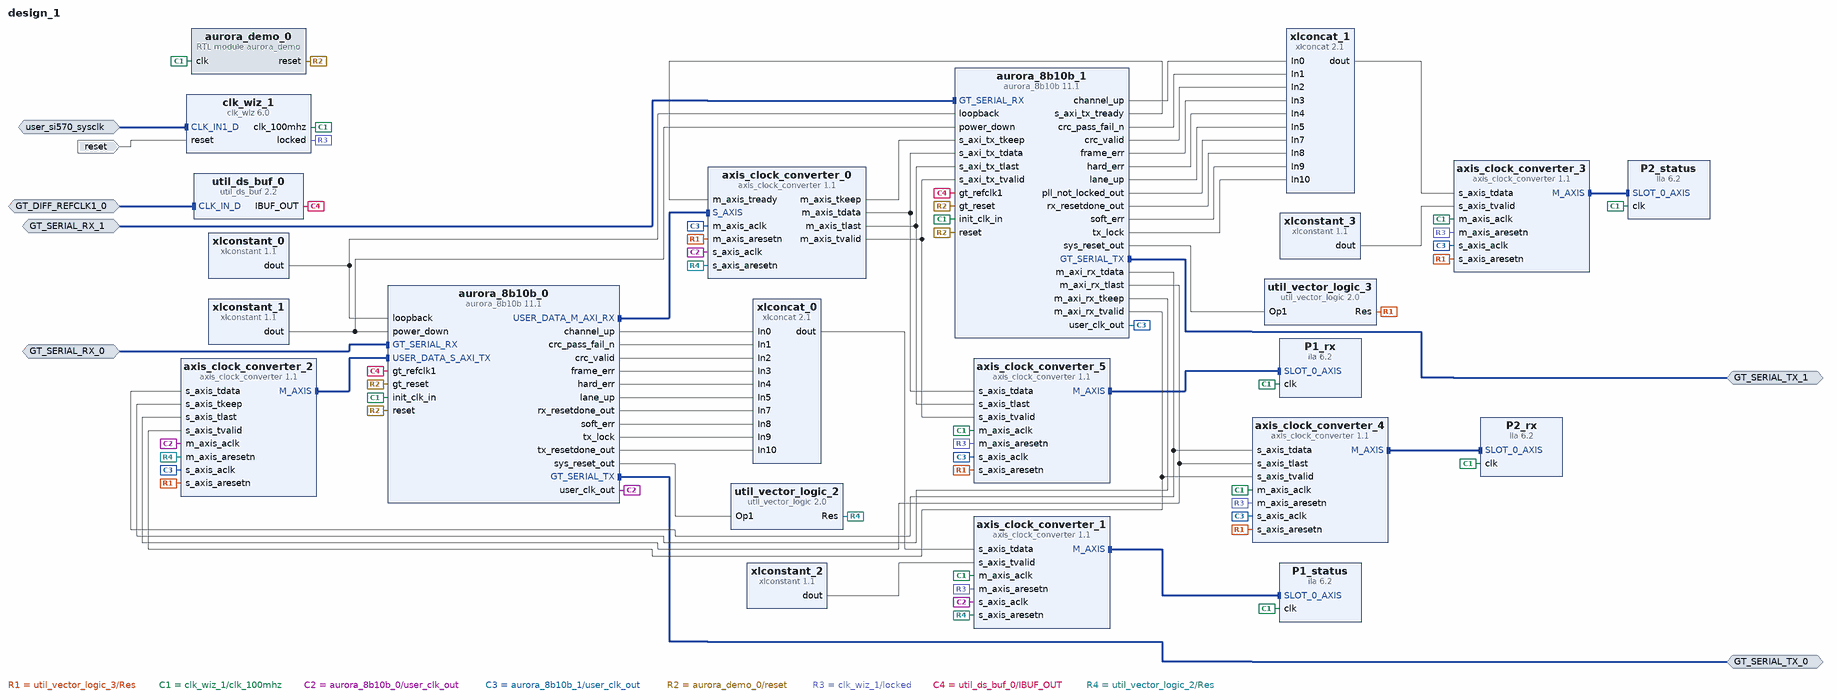
[diagram p0: block diagram of the top level]
# Vivado block design design_1, xczu7ev-ffvc1156-2-e, Vivado 2021.1
create_bd_design design_1

create_bd_intf_port -mode Slave -vlnv xilinx.com:interface:diff_clock_rtl:1.0 user_si570_sysclk
set_property -dict {CONFIG.FREQ_HZ 300000000} [get_bd_intf_ports user_si570_sysclk]
create_bd_intf_port -mode Slave -vlnv xilinx.com:display_aurora:GT_Serial_Transceiver_Pins_RX_rtl:1.0 GT_SERIAL_RX_0
create_bd_intf_port -mode Master -vlnv xilinx.com:display_aurora:GT_Serial_Transceiver_Pins_TX_rtl:1.0 GT_SERIAL_TX_0
create_bd_intf_port -mode Slave -vlnv xilinx.com:interface:diff_clock_rtl:1.0 GT_DIFF_REFCLK1_0
set_property -dict {CONFIG.FREQ_HZ 250000000} [get_bd_intf_ports GT_DIFF_REFCLK1_0]
create_bd_intf_port -mode Slave -vlnv xilinx.com:display_aurora:GT_Serial_Transceiver_Pins_RX_rtl:1.0 GT_SERIAL_RX_1
create_bd_intf_port -mode Master -vlnv xilinx.com:display_aurora:GT_Serial_Transceiver_Pins_TX_rtl:1.0 GT_SERIAL_TX_1
create_bd_port -dir I -type rst reset
set_property -dict {CONFIG.POLARITY ACTIVE_HIGH} [get_bd_ports reset]

create_bd_cell -type ip -vlnv xilinx.com:ip:aurora_8b10b:11.1 aurora_8b10b_0
set_property -dict [list \
  CONFIG.CHANNEL_ENABLE X0Y10 \
  CONFIG.C_DRP_IF false \
  CONFIG.C_LANE_WIDTH 2 \
  CONFIG.C_LINE_RATE 2 \
  CONFIG.C_REFCLK_FREQUENCY 250 \
  CONFIG.C_REFCLK_SOURCE {MGTREFCLK1 of Quad X0Y2} \
  CONFIG.C_START_LANE X0Y10 \
  CONFIG.C_START_QUAD Quad_X0Y2 \
  CONFIG.C_USE_CRC true \
  CONFIG.SINGLEEND_GTREFCLK true \
  CONFIG.SupportLevel 1 \
] [get_bd_cells aurora_8b10b_0]
create_bd_cell -type ip -vlnv xilinx.com:ip:clk_wiz:6.0 clk_wiz_1
set_property -dict [list \
  CONFIG.CLKIN1_JITTER_PS 33.330000000000005 \
  CONFIG.CLKOUT1_JITTER 101.475 \
  CONFIG.CLKOUT1_PHASE_ERROR 77.836 \
  CONFIG.CLK_IN1_BOARD_INTERFACE user_si570_sysclk \
  CONFIG.CLK_OUT1_PORT clk_100mhz \
  CONFIG.MMCM_CLKFBOUT_MULT_F 4.000 \
  CONFIG.MMCM_CLKIN1_PERIOD 3.333 \
  CONFIG.MMCM_CLKIN2_PERIOD 10.0 \
  CONFIG.PRIM_SOURCE Differential_clock_capable_pin \
  CONFIG.RESET_BOARD_INTERFACE reset \
  CONFIG.USE_BOARD_FLOW true \
] [get_bd_cells clk_wiz_1]
create_bd_cell -type ip -vlnv xilinx.com:ip:xlconstant:1.1 xlconstant_0
set_property -dict {CONFIG.CONST_VAL 0 CONFIG.CONST_WIDTH 3} [get_bd_cells xlconstant_0]
create_bd_cell -type ip -vlnv xilinx.com:ip:xlconstant:1.1 xlconstant_1
set_property -dict {CONFIG.CONST_VAL 0} [get_bd_cells xlconstant_1]
create_bd_cell -type ip -vlnv xilinx.com:ip:ila:6.2 P2_status
set_property -dict {CONFIG.C_NUM_OF_PROBES 9 CONFIG.C_SLOT_0_AXI_PROTOCOL AXI4S} [get_bd_cells P2_status]
create_bd_cell -type ip -vlnv xilinx.com:ip:axis_clock_converter:1.1 axis_clock_converter_0
set_property -dict {CONFIG.HAS_TKEEP 1 CONFIG.HAS_TLAST 1 CONFIG.TDATA_NUM_BYTES 2} [get_bd_cells axis_clock_converter_0]
create_bd_cell -type ip -vlnv xilinx.com:ip:axis_clock_converter:1.1 axis_clock_converter_1
set_property -dict {CONFIG.SYNCHRONIZATION_STAGES 3 CONFIG.TDATA_NUM_BYTES 2} [get_bd_cells axis_clock_converter_1]
create_bd_cell -type ip -vlnv xilinx.com:ip:xlconstant:1.1 xlconstant_2
set_property -dict {CONFIG.CONST_VAL 1} [get_bd_cells xlconstant_2]
create_bd_cell -type ip -vlnv xilinx.com:ip:ila:6.2 P1_status
set_property -dict {CONFIG.C_NUM_OF_PROBES 9 CONFIG.C_SLOT_0_AXI_PROTOCOL AXI4S} [get_bd_cells P1_status]
create_bd_cell -type ip -vlnv xilinx.com:ip:xlconcat:2.1 xlconcat_0
set_property -dict {CONFIG.NUM_PORTS 16} [get_bd_cells xlconcat_0]
create_bd_cell -type ip -vlnv xilinx.com:ip:axis_clock_converter:1.1 axis_clock_converter_2
set_property -dict {CONFIG.HAS_TKEEP 1 CONFIG.HAS_TLAST 1 CONFIG.TDATA_NUM_BYTES 2} [get_bd_cells axis_clock_converter_2]
create_bd_cell -type module -reference aurora_demo aurora_demo_0
create_bd_cell -type ip -vlnv xilinx.com:ip:aurora_8b10b:11.1 aurora_8b10b_1
set_property -dict [list \
  CONFIG.CHANNEL_ENABLE X0Y11 \
  CONFIG.C_DRP_IF false \
  CONFIG.C_LANE_WIDTH 2 \
  CONFIG.C_LINE_RATE 2 \
  CONFIG.C_REFCLK_FREQUENCY 250 \
  CONFIG.C_REFCLK_SOURCE {MGTREFCLK1 of Quad X0Y2} \
  CONFIG.C_START_LANE X0Y11 \
  CONFIG.C_START_QUAD Quad_X0Y2 \
  CONFIG.C_USE_CRC true \
  CONFIG.SINGLEEND_GTREFCLK true \
  CONFIG.SupportLevel 1 \
] [get_bd_cells aurora_8b10b_1]
create_bd_cell -type ip -vlnv xilinx.com:ip:util_ds_buf:2.2 util_ds_buf_0
set_property -dict {CONFIG.C_BUF_TYPE IBUFDSGTE} [get_bd_cells util_ds_buf_0]
create_bd_cell -type ip -vlnv xilinx.com:ip:xlconcat:2.1 xlconcat_1
set_property -dict {CONFIG.NUM_PORTS 16} [get_bd_cells xlconcat_1]
create_bd_cell -type ip -vlnv xilinx.com:ip:axis_clock_converter:1.1 axis_clock_converter_3
set_property -dict {CONFIG.SYNCHRONIZATION_STAGES 3 CONFIG.TDATA_NUM_BYTES 2} [get_bd_cells axis_clock_converter_3]
create_bd_cell -type ip -vlnv xilinx.com:ip:util_vector_logic:2.0 util_vector_logic_2
set_property -dict {CONFIG.C_OPERATION not CONFIG.C_SIZE 1} [get_bd_cells util_vector_logic_2]
create_bd_cell -type ip -vlnv xilinx.com:ip:util_vector_logic:2.0 util_vector_logic_3
set_property -dict {CONFIG.C_OPERATION not CONFIG.C_SIZE 1} [get_bd_cells util_vector_logic_3]
create_bd_cell -type ip -vlnv xilinx.com:ip:xlconstant:1.1 xlconstant_3
set_property -dict {CONFIG.CONST_VAL 1} [get_bd_cells xlconstant_3]
create_bd_cell -type ip -vlnv xilinx.com:ip:axis_clock_converter:1.1 axis_clock_converter_4
set_property -dict [list \
  CONFIG.HAS_TLAST 1 \
  CONFIG.SYNCHRONIZATION_STAGES 3 \
  CONFIG.TDATA_NUM_BYTES 2 \
] [get_bd_cells axis_clock_converter_4]
create_bd_cell -type ip -vlnv xilinx.com:ip:axis_clock_converter:1.1 axis_clock_converter_5
set_property -dict [list \
  CONFIG.HAS_TLAST 1 \
  CONFIG.SYNCHRONIZATION_STAGES 3 \
  CONFIG.TDATA_NUM_BYTES 2 \
] [get_bd_cells axis_clock_converter_5]
create_bd_cell -type ip -vlnv xilinx.com:ip:ila:6.2 P2_rx
set_property -dict {CONFIG.C_NUM_OF_PROBES 9 CONFIG.C_SLOT_0_AXI_PROTOCOL AXI4S} [get_bd_cells P2_rx]
create_bd_cell -type ip -vlnv xilinx.com:ip:ila:6.2 P1_rx
set_property -dict {CONFIG.C_NUM_OF_PROBES 9 CONFIG.C_SLOT_0_AXI_PROTOCOL AXI4S} [get_bd_cells P1_rx]

# ---- connections ----

connect_bd_intf_net -intf_net GT_DIFF_REFCLK1_0_1 [get_bd_intf_ports GT_DIFF_REFCLK1_0] [get_bd_intf_pins util_ds_buf_0/CLK_IN_D]
connect_bd_intf_net -intf_net GT_SERIAL_RX_0_1 [get_bd_intf_ports GT_SERIAL_RX_0] [get_bd_intf_pins aurora_8b10b_0/GT_SERIAL_RX]
connect_bd_intf_net -intf_net GT_SERIAL_RX_1_1 [get_bd_intf_ports GT_SERIAL_RX_1] [get_bd_intf_pins aurora_8b10b_1/GT_SERIAL_RX]
connect_bd_intf_net [get_bd_intf_ports GT_SERIAL_TX_0] [get_bd_intf_pins aurora_8b10b_0/GT_SERIAL_TX]
connect_bd_intf_net [get_bd_intf_pins axis_clock_converter_0/S_AXIS] [get_bd_intf_pins aurora_8b10b_0/USER_DATA_M_AXI_RX]
connect_bd_intf_net [get_bd_intf_ports GT_SERIAL_TX_1] [get_bd_intf_pins aurora_8b10b_1/GT_SERIAL_TX]
connect_bd_intf_net [get_bd_intf_pins axis_clock_converter_1/M_AXIS] [get_bd_intf_pins P1_status/SLOT_0_AXIS]
connect_bd_intf_net [get_bd_intf_pins axis_clock_converter_2/M_AXIS] [get_bd_intf_pins aurora_8b10b_0/USER_DATA_S_AXI_TX]
connect_bd_intf_net [get_bd_intf_pins axis_clock_converter_3/M_AXIS] [get_bd_intf_pins P2_status/SLOT_0_AXIS]
connect_bd_intf_net [get_bd_intf_pins axis_clock_converter_4/M_AXIS] [get_bd_intf_pins P2_rx/SLOT_0_AXIS]
connect_bd_intf_net [get_bd_intf_pins axis_clock_converter_5/M_AXIS] [get_bd_intf_pins P1_rx/SLOT_0_AXIS]
connect_bd_intf_net [get_bd_intf_ports user_si570_sysclk] [get_bd_intf_pins clk_wiz_1/CLK_IN1_D]
connect_bd_net [get_bd_pins axis_clock_converter_0/m_axis_tdata] \
  [get_bd_pins axis_clock_converter_5/s_axis_tdata] [get_bd_pins aurora_8b10b_1/s_axi_tx_tdata]
connect_bd_net [get_bd_pins axis_clock_converter_0/m_axis_tlast] \
  [get_bd_pins axis_clock_converter_5/s_axis_tlast] [get_bd_pins aurora_8b10b_1/s_axi_tx_tlast]
connect_bd_net [get_bd_pins util_vector_logic_3/Res] \
  [get_bd_pins axis_clock_converter_2/s_axis_aresetn] [get_bd_pins axis_clock_converter_4/s_axis_aresetn] \
  [get_bd_pins axis_clock_converter_0/m_axis_aresetn] [get_bd_pins axis_clock_converter_5/s_axis_aresetn] \
  [get_bd_pins axis_clock_converter_3/s_axis_aresetn]
connect_bd_net [get_bd_pins clk_wiz_1/clk_100mhz] \
  [get_bd_pins axis_clock_converter_3/m_axis_aclk] [get_bd_pins P2_status/clk] [get_bd_pins P1_status/clk] \
  [get_bd_pins axis_clock_converter_1/m_axis_aclk] [get_bd_pins aurora_demo_0/clk] \
  [get_bd_pins axis_clock_converter_5/m_axis_aclk] [get_bd_pins axis_clock_converter_4/m_axis_aclk] [get_bd_pins P2_rx/clk] \
  [get_bd_pins P1_rx/clk] [get_bd_pins aurora_8b10b_1/init_clk_in] [get_bd_pins aurora_8b10b_0/init_clk_in]
connect_bd_net [get_bd_pins aurora_8b10b_0/channel_up] [get_bd_pins xlconcat_0/In0]
connect_bd_net [get_bd_pins aurora_8b10b_0/crc_pass_fail_n] [get_bd_pins xlconcat_0/In1]
connect_bd_net [get_bd_pins aurora_8b10b_0/crc_valid] [get_bd_pins xlconcat_0/In2]
connect_bd_net [get_bd_pins aurora_8b10b_0/frame_err] [get_bd_pins xlconcat_0/In3]
connect_bd_net [get_bd_pins aurora_8b10b_0/hard_err] [get_bd_pins xlconcat_0/In4]
connect_bd_net [get_bd_pins aurora_8b10b_0/lane_up] [get_bd_pins xlconcat_0/In5]
connect_bd_net [get_bd_pins aurora_8b10b_0/rx_resetdone_out] [get_bd_pins xlconcat_0/In7]
connect_bd_net [get_bd_pins aurora_8b10b_0/soft_err] [get_bd_pins xlconcat_0/In8]
connect_bd_net [get_bd_pins aurora_8b10b_0/sys_reset_out] [get_bd_pins util_vector_logic_2/Op1]
connect_bd_net [get_bd_pins aurora_8b10b_0/tx_lock] [get_bd_pins xlconcat_0/In9]
connect_bd_net [get_bd_pins aurora_8b10b_0/tx_resetdone_out] [get_bd_pins xlconcat_0/In10]
connect_bd_net [get_bd_pins aurora_8b10b_0/user_clk_out] \
  [get_bd_pins axis_clock_converter_2/m_axis_aclk] [get_bd_pins axis_clock_converter_0/s_axis_aclk] \
  [get_bd_pins axis_clock_converter_1/s_axis_aclk]
connect_bd_net [get_bd_pins aurora_8b10b_1/channel_up] [get_bd_pins xlconcat_1/In0]
connect_bd_net [get_bd_pins aurora_8b10b_1/crc_pass_fail_n] [get_bd_pins xlconcat_1/In1]
connect_bd_net [get_bd_pins aurora_8b10b_1/crc_valid] [get_bd_pins xlconcat_1/In2]
connect_bd_net [get_bd_pins aurora_8b10b_1/frame_err] [get_bd_pins xlconcat_1/In3]
connect_bd_net [get_bd_pins aurora_8b10b_1/hard_err] [get_bd_pins xlconcat_1/In4]
connect_bd_net [get_bd_pins aurora_8b10b_1/lane_up] [get_bd_pins xlconcat_1/In5]
connect_bd_net [get_bd_pins aurora_8b10b_1/m_axi_rx_tdata] \
  [get_bd_pins axis_clock_converter_2/s_axis_tdata] [get_bd_pins axis_clock_converter_4/s_axis_tdata]
connect_bd_net [get_bd_pins aurora_8b10b_1/m_axi_rx_tkeep] [get_bd_pins axis_clock_converter_2/s_axis_tkeep]
connect_bd_net [get_bd_pins aurora_8b10b_1/m_axi_rx_tlast] \
  [get_bd_pins axis_clock_converter_2/s_axis_tlast] [get_bd_pins axis_clock_converter_4/s_axis_tlast]
connect_bd_net [get_bd_pins aurora_8b10b_1/m_axi_rx_tvalid] \
  [get_bd_pins axis_clock_converter_2/s_axis_tvalid] [get_bd_pins axis_clock_converter_4/s_axis_tvalid]
connect_bd_net [get_bd_pins aurora_8b10b_1/pll_not_locked_out] [get_bd_pins xlconcat_1/In7]
connect_bd_net [get_bd_pins aurora_8b10b_1/rx_resetdone_out] [get_bd_pins xlconcat_1/In8]
connect_bd_net [get_bd_pins aurora_8b10b_1/s_axi_tx_tready] [get_bd_pins axis_clock_converter_0/m_axis_tready]
connect_bd_net [get_bd_pins aurora_8b10b_1/soft_err] [get_bd_pins xlconcat_1/In9]
connect_bd_net [get_bd_pins aurora_8b10b_1/sys_reset_out] [get_bd_pins util_vector_logic_3/Op1]
connect_bd_net [get_bd_pins aurora_8b10b_1/tx_lock] [get_bd_pins xlconcat_1/In10]
connect_bd_net [get_bd_pins aurora_8b10b_1/user_clk_out] \
  [get_bd_pins axis_clock_converter_2/s_axis_aclk] [get_bd_pins axis_clock_converter_4/s_axis_aclk] \
  [get_bd_pins axis_clock_converter_0/m_axis_aclk] [get_bd_pins axis_clock_converter_5/s_axis_aclk] \
  [get_bd_pins axis_clock_converter_3/s_axis_aclk]
connect_bd_net [get_bd_pins aurora_demo_0/reset] \
  [get_bd_pins aurora_8b10b_0/reset] [get_bd_pins aurora_8b10b_0/gt_reset] [get_bd_pins aurora_8b10b_1/reset] \
  [get_bd_pins aurora_8b10b_1/gt_reset]
connect_bd_net [get_bd_pins axis_clock_converter_0/m_axis_tkeep] [get_bd_pins aurora_8b10b_1/s_axi_tx_tkeep]
connect_bd_net [get_bd_pins axis_clock_converter_0/m_axis_tvalid] \
  [get_bd_pins aurora_8b10b_1/s_axi_tx_tvalid] [get_bd_pins axis_clock_converter_5/s_axis_tvalid]
connect_bd_net [get_bd_pins clk_wiz_1/locked] \
  [get_bd_pins axis_clock_converter_1/m_axis_aresetn] [get_bd_pins axis_clock_converter_3/m_axis_aresetn] \
  [get_bd_pins axis_clock_converter_4/m_axis_aresetn] [get_bd_pins axis_clock_converter_5/m_axis_aresetn]
connect_bd_net [get_bd_ports reset] [get_bd_pins clk_wiz_1/reset]
connect_bd_net [get_bd_pins util_ds_buf_0/IBUF_OUT] [get_bd_pins aurora_8b10b_1/gt_refclk1] [get_bd_pins aurora_8b10b_0/gt_refclk1]
connect_bd_net [get_bd_pins util_vector_logic_2/Res] \
  [get_bd_pins axis_clock_converter_2/m_axis_aresetn] [get_bd_pins axis_clock_converter_0/s_axis_aresetn] \
  [get_bd_pins axis_clock_converter_1/s_axis_aresetn]
connect_bd_net [get_bd_pins xlconcat_0/dout] [get_bd_pins axis_clock_converter_1/s_axis_tdata]
connect_bd_net [get_bd_pins xlconcat_1/dout] [get_bd_pins axis_clock_converter_3/s_axis_tdata]
connect_bd_net [get_bd_pins xlconstant_0/dout] [get_bd_pins aurora_8b10b_0/loopback] [get_bd_pins aurora_8b10b_1/loopback]
connect_bd_net [get_bd_pins xlconstant_1/dout] [get_bd_pins aurora_8b10b_0/power_down] [get_bd_pins aurora_8b10b_1/power_down]
connect_bd_net [get_bd_pins xlconstant_2/dout] [get_bd_pins axis_clock_converter_1/s_axis_tvalid]
connect_bd_net [get_bd_pins xlconstant_3/dout] [get_bd_pins axis_clock_converter_3/s_axis_tvalid]

validate_bd_design
save_bd_design
